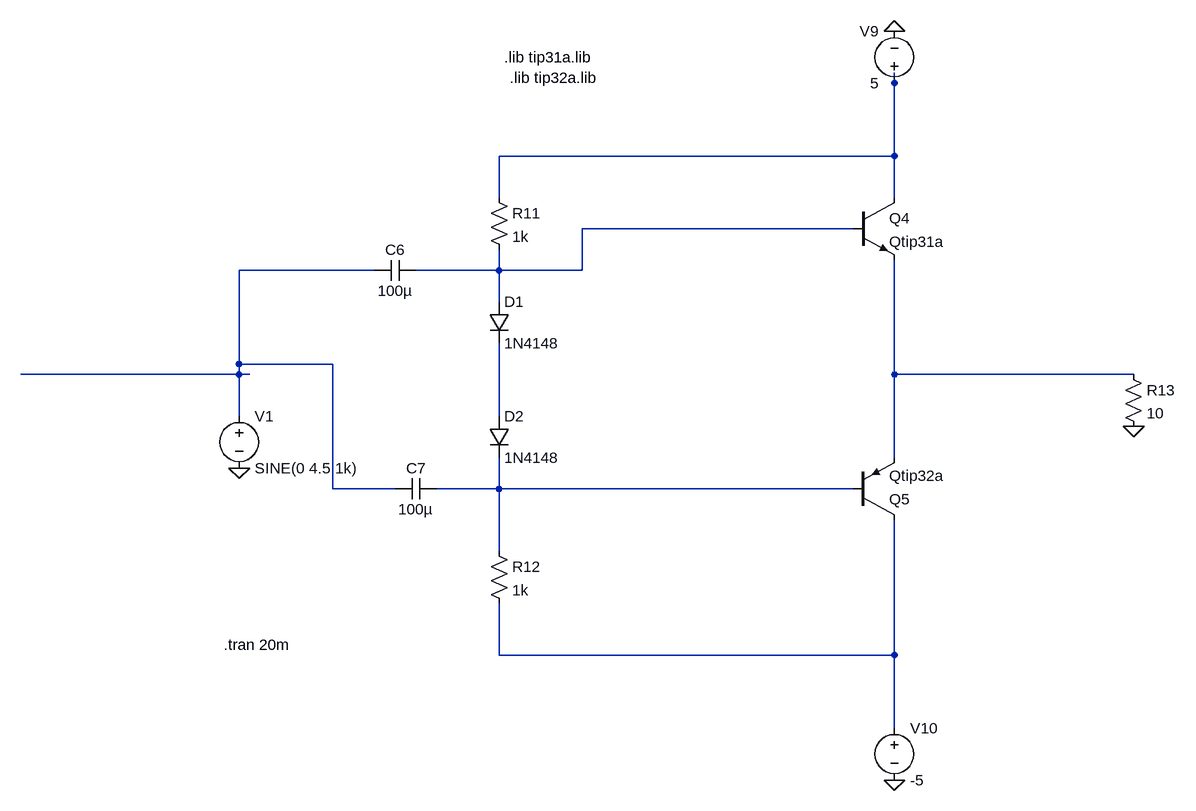
[diagram p0: schematic power_stage.asc]
power_stage.asc, the LTspice schematic file:
Version 4
SHEET 1 5540 740
WIRE 4032 -368 4032 -384
WIRE 4032 -256 4032 -368
WIRE 4032 -256 3424 -256
WIRE 3424 -192 3424 -256
WIRE 4032 -192 4032 -256
WIRE 3968 -144 3552 -144
WIRE 3232 -80 3024 -80
WIRE 3424 -80 3424 -112
WIRE 3424 -80 3296 -80
WIRE 3552 -80 3552 -144
WIRE 3552 -80 3424 -80
WIRE 3424 -32 3424 -80
WIRE 3024 64 3024 -80
WIRE 3168 64 3024 64
WIRE 3024 80 3024 64
WIRE 3024 80 2688 80
WIRE 3040 80 3024 80
WIRE 4032 80 4032 -96
WIRE 4400 80 4032 80
WIRE 3024 144 3024 80
WIRE 3424 144 3424 32
WIRE 4032 208 4032 80
WIRE 3168 256 3168 64
WIRE 3264 256 3168 256
WIRE 3424 256 3424 208
WIRE 3424 256 3328 256
WIRE 3968 256 3424 256
WIRE 3424 352 3424 256
WIRE 3424 512 3424 432
WIRE 4032 512 4032 304
WIRE 4032 512 3424 512
WIRE 4032 624 4032 512
FLAG 4400 160 0
FLAG 4032 -448 0
FLAG 4032 704 0
FLAG 3024 224 0
SYMBOL res 3408 -208 R0
SYMATTR InstName R11
SYMATTR Value 1k
SYMBOL diode 3408 -32 R0
SYMATTR InstName D1
SYMATTR Value 1N4148
SYMBOL diode 3408 144 R0
SYMATTR InstName D2
SYMATTR Value 1N4148
SYMBOL res 3408 336 R0
SYMATTR InstName R12
SYMATTR Value 1k
SYMBOL npn 3968 -192 R0
SYMATTR InstName Q4
SYMATTR Value Qtip31a
SYMBOL pnp 3968 304 M180
SYMATTR InstName Q5
SYMATTR Value Qtip32a
SYMBOL res 4384 64 R0
SYMATTR InstName R13
SYMATTR Value 10
SYMBOL voltage 4032 -352 R180
WINDOW 0 24 96 Left 2
WINDOW 3 24 16 Left 2
WINDOW 123 0 0 Left 0
WINDOW 39 0 0 Left 0
SYMATTR InstName V9
SYMATTR Value 5
SYMBOL voltage 4032 608 R0
WINDOW 123 0 0 Left 0
WINDOW 39 0 0 Left 0
SYMATTR InstName V10
SYMATTR Value -5
SYMBOL cap 3296 -96 R90
WINDOW 0 0 32 VBottom 2
WINDOW 3 32 32 VTop 2
SYMATTR InstName C6
SYMATTR Value 100µ
SYMBOL cap 3328 240 R90
WINDOW 0 0 32 VBottom 2
WINDOW 3 32 32 VTop 2
SYMATTR InstName C7
SYMATTR Value 100µ
SYMBOL voltage 3024 128 R0
WINDOW 123 0 0 Left 0
WINDOW 39 0 0 Left 0
SYMATTR InstName V1
SYMATTR Value SINE(0 4.5 1k)
TEXT 3000 496 Left 2 !.tran 20m
TEXT 3432 -408 Left 2 !.lib tip31a.lib
TEXT 3440 -376 Left 2 !.lib tip32a.lib

The netlist it stands for:
* power_stage.asc
R11 N001 N002 1k
D1 N002 N005 1N4148
D2 N005 N006 1N4148
R12 N006 N007 1k
Q4 N001 N002 N004 0 Qtip31a
Q5 N007 N006 N004 0 Qtip32a
R13 N004 0 10
V9 N001 0 5
V10 N007 0 -5
C6 N002 N003 100µ
C7 N006 N003 100µ
V1 N003 0 SINE(0 4.5 1k)
.model D D
.lib standard.dio
.model NPN NPN
.model PNP PNP
.lib standard.bjt
.tran 20m
.lib tip31a.lib
.lib tip32a.lib
.backanno
.end